# Altium schematic sheet [4]-Ethernet_PHY.SchDoc
size A4
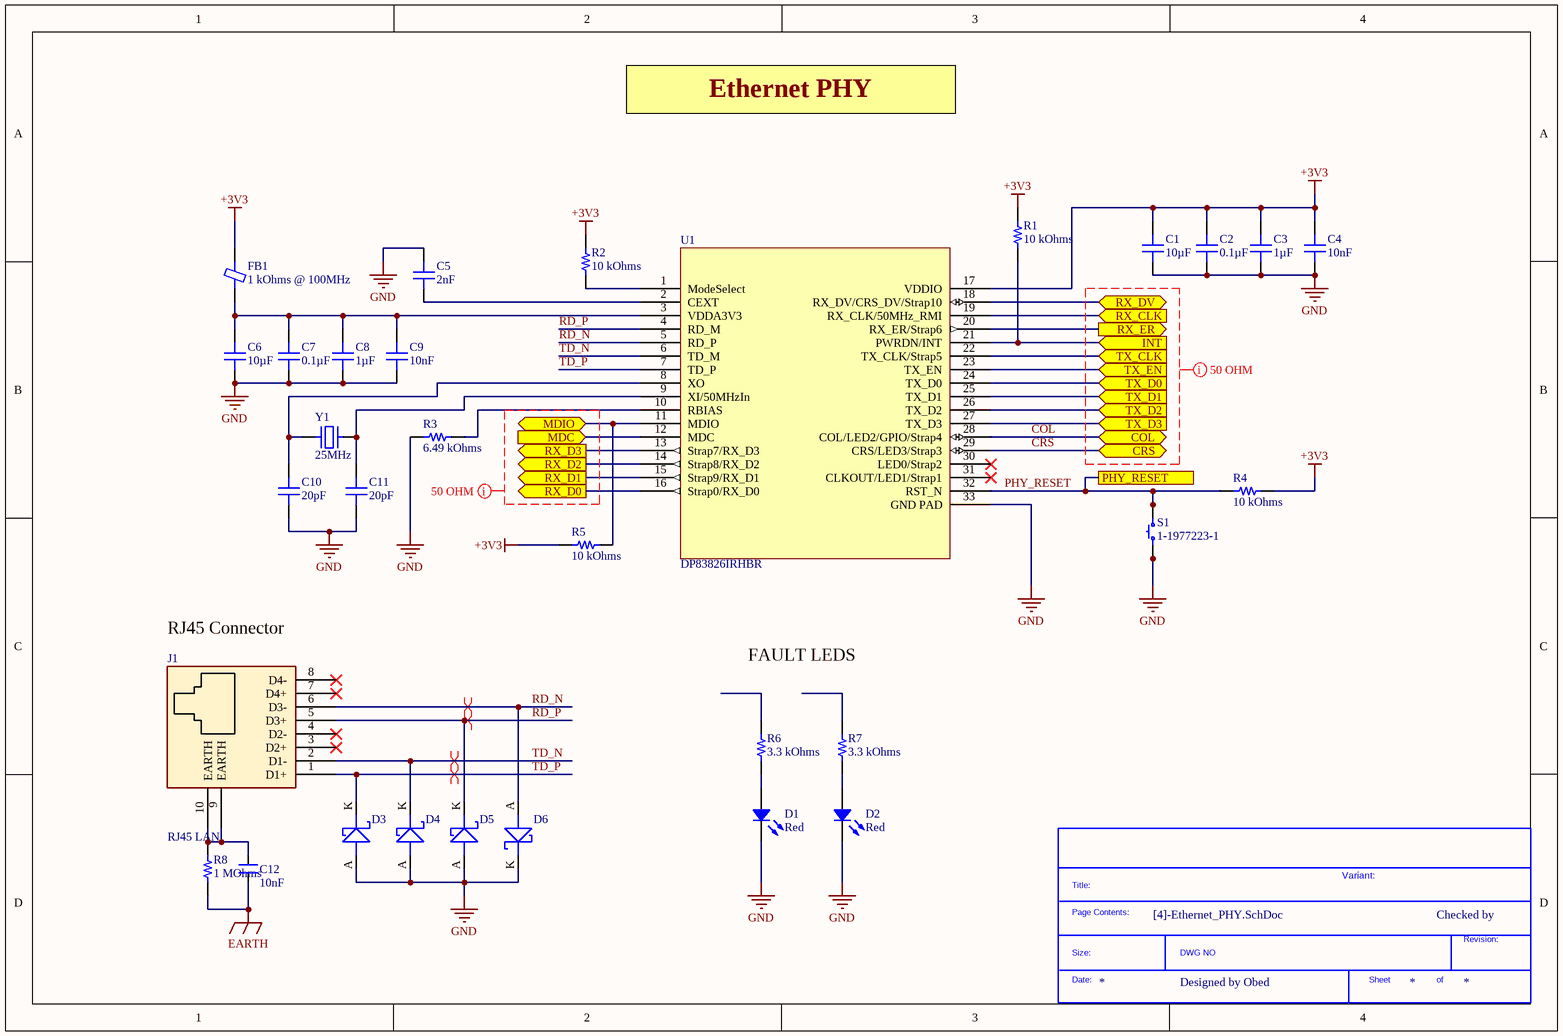
[diagram p0: [4]-Ethernet_PHY.SchDoc]

## Parts
*?  SDTitleBlock  (value not drawn)  (graphical)
C1  10µF  [CAP 1206_3216 - 1.8MM]
C2  0.1µF  [CAP 0805_2012]
C3  1µF  [CAP 0805_2012]
C4  10nF  [CAP 0805_2012]
C5  2nF  [CAP 0805_2012]
C6  10µF  [CAP 1206_3216 - 1.8MM]
C7  0.1µF  [CAP 0805_2012]
C8  1µF  [CAP 0805_2012]
C9  10nF  [CAP 0805_2012]
C10  20pF  [CAP 0805_2012]
C11  20pF  [CAP 0805_2012]
C12  10nF  [CAP_P196_102X287_H332_RAD_TH]
D1  Red  [LED 1206_3216 RED]
D2  Red  [LED 1206_3216 RED]
D3  ESD3V3D9-TP  [DIO_SOD-923]  (value not drawn)
D4  ESD3V3D9-TP  [DIO_SOD-923]  (value not drawn)
D5  ESD3V3D9-TP  [DIO_SOD-923]  (value not drawn)
D6  ESD3V3D9-TP  [DIO_SOD-923]  (value not drawn)
FB1  1 kOhms @ 100MHz  [FER 1206_3216]
J1  RJ45 LAN  [CON10_P106_RJ45_TH_ST]
R1  10 kOhms  [RES 0805_2012]
R2  10 kOhms  [RES 0805_2012]
R3  6.49 kOhms  [RES 0805_2012]
R4  10 kOhms  [RES 0805_2012]
R5  10 kOhms  [RES 0805_2012]
R6  3.3 kOhms  [RES 0603_1608]
R7  3.3 kOhms  [RES 0603_1608]
R8  1 MOhms  [RES 1206_3216]
S1  1-1977223-1  [TE FSM4JSMA]
U1  DP83826IRHBR  [VQFN32_19_218_23X9_SMD]
Y1  25MHz  [ABRACON ABLS]

## Ports
COL (bidir), CRS (bidir), INT (in), MDC (in), MDIO (bidir), PHY_RESET, RX_CLK (in), RX_D0 (out), RX_D1 (out), RX_D2 (out), RX_D3 (out), RX_DV (bidir), RX_ER (out), TX_CLK (in), TX_D0 (in), TX_D1 (in), TX_D2 (in), TX_D3 (in), TX_EN (in)

## Nets
+3V3: C1.2 C2.2 C3.2 C4.2 FB1.2 R1.2 R2.2 R4.1 R5.1 U1.17(VDDIO)
EARTH: C12.1 R8.1
GND: C1.1 C2.1 C3.1 C4.1 C5.2 C6.1 C7.1 C8.1 C9.1 C10.1 C11.1 D1.2 D2.2 D3.A D4.A D5.A D6.K R3.1 S1.1 S1.2 U1.33(GND_PAD)
COL: U1.28(COL/LED2/GPIO/Strap4) ; port COL
CRS: U1.29(CRS/LED3/Strap3) ; port CRS
INT: R1.1 U1.21(PWRDN/INT) ; port INT
MDC: U1.12(MDC) ; port MDC
MDIO: R5.2 U1.11(MDIO) ; port MDIO
PHY_RESET: R4.2 S1.3 S1.4 U1.32(RST_N) ; port PHY_RESET
RD_N: D6.A J1.6(D3-) U1.5(RD_P)
RD_P: D5.K J1.5(D3+) U1.4(RD_M)
RX_CLK: U1.19(RX_CLK/50MHz_RMI) ; port RX_CLK
RX_D0: U1.16(Strap0/RX_D0) ; port RX_D0
RX_D1: U1.15(Strap9/RX_D1) ; port RX_D1
RX_D2: U1.14(Strap8/RX_D2) ; port RX_D2
RX_D3: U1.13(Strap7/RX_D3) ; port RX_D3
RX_DV: U1.18(RX_DV/CRS_DV/Strap10) ; port RX_DV
RX_ER: U1.20(RX_ER/Strap6) ; port RX_ER
TD_N: D4.K J1.2(D1-) U1.6(TD_M)
TD_P: D3.K J1.1(D1+) U1.7(TD_P)
TX_CLK: U1.22(TX_CLK/Strap5) ; port TX_CLK
TX_D0: U1.24(TX_D0) ; port TX_D0
TX_D1: U1.25(TX_D1) ; port TX_D1
TX_D2: U1.26(TX_D2) ; port TX_D2
TX_D3: U1.27(TX_D3) ; port TX_D3
TX_EN: U1.23(TX_EN) ; port TX_EN
NetC5_1: C5.1 U1.2(CEXT)
NetC6_2: C6.2 C7.2 C8.2 C9.2 FB1.1 U1.3(VDDA3V3)
NetC10_2: C10.2 U1.8(XO) Y1.1
NetC11_2: C11.2 U1.9(XI/50MHzIn) Y1.2
NetC12_2: C12.2 J1.9(EARTH) J1.10(EARTH) R8.2
NetD1_1: D1.1 R6.2
NetD2_1: D2.1 R7.1
NetR2_1: R2.1 U1.1(ModeSelect)
NetR3_2: R3.2 U1.10(RBIAS)

Not connected (* = marked no-connect by the designer): J1 3(D2+)* 4(D2-)* 7(D4+)* 8(D4-)*; R6 1; R7 2; U1 30(LED0/Strap2)* 31(CLKOUT/LED1/Strap1)*

## Layout directives
net class 50OHM SINGLE-ENDED: (no net found under the mark)
differential pair; differential pair class 100 OHM; net class DIFF100: RD_N, RD_P, TD_N, TD_P

## Notes on the sheet
- Ethernet PHY
- (near J1) RJ45 Connector
- FAULT LEDS
- Variant:
- Checked by
- Designed by Obed
- (in symbol SDTitleBlock) Title:; Page Contents:; Revision:; Size:; DWG NO; Date:; Sheet; of

## Library data of the parts
C1 C6 = 12065D106KAT2A: CAP CER 10UF 50V X5R 1206; Manufacturer: AVX Corporation; Tolerance: ±10%; Part Number: 12065D106KAT2A; Applications: General Purpose; Capacitance: 10µF; ComponentLink1Description: Datasheet; ComponentLink1URL: http://datasheets.avx.com/cx5r.pdf; ComponentLink2Description: DigiKey Link; ComponentLink2URL: http://digikey.com/product-detail/en/avx-corporation/12065D106KAT2A/478-9979-1-ND/6149060; Device Package: 1206 (3216 Metric); LastUpdated: 02/09/2020 01:05:35; Lifecycle Status: Active; Minimum Order: 1; Mounting Type: Surface Mount, MLCC; Operating Temperature: -55°C ~ 85°C; Package / Case: 1206 (3216 Metric); Packaging: TapeAndReel; PartId: 21345; Part Status: Active; Price: 0.16; Series: -; Size / Dimension: 0.126" L x 0.063" W (3.20mm x 1.60mm); Supplier 1: DigiKey; Supplier Part Number 1: 478-9979-1-ND; Temperature Coefficient: X5R; Thickness (Max): 0.071" (1.80mm); Voltage - Rated: 50V; Value: 10µF
C2 C7 = 0805J0500104KXT: CAP CER 0.1UF 50V X7R 0805; Manufacturer: Knowles Syfer; Tolerance: ±10%; Part Number: 0805J0500104KXT; Applications: General Purpose; Capacitance: 0.1µF; ComponentLink1Description: Datasheet; ComponentLink1URL: https://www.knowlescapacitors.com/getattachment/2dbfc8bc-e2b3-4b4d-afb1-43b011b9ebe0/High-Std-Voltage.aspx; ComponentLink2Description: DigiKey Link; ComponentLink2URL: http://digikey.com/product-detail/en/knowles-syfer/0805J0500104KXT/1608-1000-1-ND/5730199; Device Package: 0805 (2012 Metric); LastUpdated: 02/09/2020 01:04:31; Lifecycle Status: Active; Minimum Order: 1; Mounting Type: Surface Mount, MLCC; Operating Temperature: -55°C ~ 125°C; Package / Case: 0805 (2012 Metric); Packaging: TapeAndReel; PartId: 8322; Part Status: Active; Price: 0.17; Series: -; Size / Dimension: 0.079" L x 0.049" W (2.00mm x 1.25mm); Supplier 1: DigiKey; Supplier Part Number 1: 1608-1000-1-ND; Temperature Coefficient: X7R; Thickness (Max): 0.051" (1.30mm); Voltage - Rated: 50V; Value: 0.1µF
C3 C8 = 08055C105K4T2A: CAP CER 1UF 50V X7R 0805; Manufacturer: AVX Corporation; Tolerance: ±10%; Part Number: 08055C105K4T2A; Applications: Automotive; Capacitance: 1µF; ComponentLink1Description: Datasheet; ComponentLink1URL: http://datasheets.avx.com/AutoMLCC.pdf; ComponentLink2Description: DigiKey Link; ComponentLink2URL: http://digikey.com/product-detail/en/avx-corporation/08055C105K4T2A/478-9556-1-ND/5322894; Device Package: 0805 (2012 Metric); LastUpdated: 02/09/2020 01:04:35; Lifecycle Status: Active; Minimum Order: 1; Mounting Type: Surface Mount, MLCC; Operating Temperature: -55°C ~ 125°C; Package / Case: 0805 (2012 Metric); Packaging: TapeAndReel; PartId: 6460; Part Status: Active; Price: 0.08; Ratings: AEC-Q200; Series: -; Size / Dimension: 0.079" L x 0.049" W (2.00mm x 1.25mm); Supplier 1: DigiKey; Supplier Part Number 1: 478-9556-1-ND; Temperature Coefficient: X7R; Thickness (Max): 0.055" (1.40mm); Voltage - Rated: 50V; Value: 1µF
C4 C9 = C0805C103K5GECAUTO: CAP CER 0805 10NF 50V C0G 10%; Manufacturer: KEMET; Capacitance: 10000pF; Temperature Coefficient: C0G, NP0; Part Number: C0805C103K5GECAUTO; Applications: Automotive, ESD Protection; ComponentLink1Description: Datasheet; ComponentLink1URL: https://api.kemet.com/component-edge/download/datasheet/C0805C103K5GECAUTO.pdf; ComponentLink2Description: DigiKey Link; ComponentLink2URL: http://digikey.com/product-detail/en/kemet/C0805C103K5GECAUTO/399-17903-1-ND/8640570; Device Package: 0805 (2012 Metric); Features: Low ESL; LastUpdated: 02/09/2020 01:04:06; Lifecycle Status: Active; Minimum Order: 1; Mounting Type: Surface Mount, MLCC; Operating Temperature: -55°C ~ 125°C; Package / Case: 0805 (2012 Metric); Packaging: TapeAndReel; PartId: 18336; Part Status: Active; Price: 0.06; Ratings: AEC-Q200; Series: ESD SMD Auto C0G; Size / Dimension: 0.079" L x 0.049" W (2.00mm x 1.25mm); Supplier 1: DigiKey; Supplier Part Number 1: 399-17903-1-ND; Thickness (Max): 0.039" (1.00mm); Tolerance: ±10%; Voltage - Rated: 50V; Value: 10nF
C5 = C0805C202K5RACTU: CAP CER 2000PF 50V X7R 0805; Manufacturer: KEMET; Tolerance: ±10%; Part Number: C0805C202K5RACTU; Applications: Bypass, Decoupling; Capacitance: 2000pF; ComponentLink1Description: Datasheet; ComponentLink1URL: https://content.kemet.com/datasheets/KEM_C1002_X7R_SMD.pdf; ComponentLink2Description: DigiKey Link; ComponentLink2URL: http://digikey.com/product-detail/en/kemet/C0805C202K5RACTU/399-7343-1-ND/3316964; Device Package: 0805 (2012 Metric); LastUpdated: 02/09/2020 01:04:17; Lifecycle Status: Active; Minimum Order: 1; Mounting Type: Surface Mount, MLCC; Operating Temperature: -55°C ~ 125°C; Package / Case: 0805 (2012 Metric); Packaging: TapeAndReel; PartId: 14983; Part Status: Active; Price: 0.03; Series: SMD Comm X7R; Size / Dimension: 0.079" L x 0.049" W (2.00mm x 1.25mm); Supplier 1: DigiKey; Supplier Part Number 1: 399-7343-1-ND; Temperature Coefficient: X7R; Thickness (Max): 0.035" (0.88mm); Voltage - Rated: 50V; Value: 2nF
C10 C11 = 08055A200F4T2A: CAP CER 20PF 50V NP0 0805; Manufacturer: AVX Corporation; Temperature Coefficient: C0G, NP0; Tolerance: ±1%; Part Number: 08055A200F4T2A; Applications: Automotive; Capacitance: 20pF; ComponentLink1Description: Datasheet; ComponentLink1URL: http://datasheets.avx.com/C0GNP0-Dielectric.pdf; ComponentLink2Description: DigiKey Link; ComponentLink2URL: http://digikey.com/product-detail/en/avx-corporation/08055A200F4T2A/478-13059-1-ND/9948577; Device Package: 0805 (2012 Metric); LastUpdated: 02/09/2020 01:04:29; Lifecycle Status: Active; Minimum Order: 1; Mounting Type: Surface Mount, MLCC; Operating Temperature: -55°C ~ 125°C; Package / Case: 0805 (2012 Metric); Packaging: TapeAndReel; PartId: 9474; Part Status: Active; Price: 0.11; Ratings: AEC-Q200; Series: -; Size / Dimension: 0.079" L x 0.049" W (2.01mm x 1.25mm); Supplier 1: DigiKey; Supplier Part Number 1: 478-13059-1-ND; Voltage - Rated: 50V; Value: 20pF
C12 = CAP_10nF-1KV-10%-RAD-TH: Cap Ceramic 0.001uF 1000V X7R 10% Radial 5mm 125°C Bulk; Manufacturer: Murata; Manufacturer Part Number: RDER73A102K2K1H03B; Capacitance: 1nF; Voltage Rating: 1kV; Lead/Base Style: Formed Leads; Lead Diameter: 0.5mm; Supplier 1: Digi-Key; RoHS: Yes; Category: Ceramic Capacitors; Stock 1: 6888; Pricing 1: 1=0.75000, 10=0.53200, 50=0.40220, 100=0.35030, 500=0.25946, 1000=0.22055, 2500=0.20758, 5000=0.19460 (USD); Mount: Through Hole; Case/Package: Radial; Min Operating Temperature: -55°C; Max Operating Temperature: 125°C; Package Quantity: 500; Packaging: Bulk; Tolerance: 10%; Dielectric: X7R; Termination: Radial; Resistor Type: Ceramic; Voltage Rating (DC): 1kV; Length: 5.5mm; Width: 0.124inch; Height: 4mm; Height - Seated (Max): 0.157inch; Lead Pitch: 0.197inch; Lead Free: Lead Free; RoHS Compliant: Yes; ComponentLink1URL: https://datasheet.ciiva.com/29539/product-29539129.pdf?src-supplier=Digi-Key; ComponentLink1Description: https://datasheet.ciiva.com/29539/product-29539129.pdf?src-supplier=Digi-Key; Supplier Part Number 1: 490-8942-ND
D1 D2 = APTR3216SECK/J3-PRV: LED SMD; Manufacturer: Kingbright; Configuration: 1206; Current - Test: 20mA; Lens Color: Colorless; Lens Size: 1.60mm x 1.40mm; Lens Style: Rectangle with Flat Top; Lens Transparency: Clear; Millicandela Rating: 350mcd; Viewing Angle: 140°; Voltage - Forward (Vf) (Typ): 2.2V; Wavelength - Dominant: 625nm; Wavelength - Peak: 640nm; Part Number: APTR3216SECK/J3-PRV; Color: Red; ComponentLink1Description: Datasheet; ComponentLink1URL: http://www.kingbrightusa.com/images/catalog/SPEC/APTR3216SECK-J3-PRV.pdf; ComponentLink2Description: DigiKey Link; ComponentLink2URL: http://digikey.com/product-detail/en/kingbright/APTR3216SECK-J3-PRV/754-APTR3216SECK-J3-PRVCT-ND/10293112; Device Package: 1206 (3216 Metric); Height (Max): 1.25mm; LastUpdated: 9/2/2020 01:21:09; Lifecycle Status: Active; Minimum Order: 1; Mounting Type: Surface Mount; Package / Case: 1206 (3216 Metric); Packaging: TapeAndReel; PartId: 194; Part Status: Active; Price: 0.20; Series: Heli-R; Size / Dimension: 3.20mm L x 1.60mm W; Supplier 1: DigiKey; Supplier Part Number 1: 754-APTR3216SECK/J3-PRVCT-ND; Supplier Device Package: 1206; Value: Red
D3-D6 = DIO-T_3.3V-8.8V-SOD923: TVS DIODE 3.3V 8.8V SOD923; Manufacturer: MCC; Capacitance: 35pF; Current Rating: 10mA; Number of Unidirectional Channels: 1; Min Breakdown Voltage: 5V; Clamping Voltage: 5.8V; Peak Pulse Power: 100W; Power Line Protection: No; Peak Pulse Current: 5A; Diode Type: ZENER; Supplier 1: Digi-Key; Manufacturer Part Number: ESD3V3D9-TP; RoHS: Yes; Category: TVS Diodes; Stock 1: 2991; Pricing 1: 1=0.29000, 10=0.23600, 100=0.12540, 500=0.08250, 1000=0.05610, 2000=0.05060 (USD); Mount: Surface Mount; Min Operating Temperature: -55°C; Max Operating Temperature: 150°C; Package Quantity: 1; Packaging: Tape and Reel; Operating Supply Voltage: 3.3V; Reverse Standoff Voltage: 3.3V; Breakdown Voltage: 5V; Number of Channels: 1; Max Power Dissipation: 100W; Termination: SMD/SMT; Resistor Type: Zener; Series: -; Lead Free: Lead Free; RoHS Compliant: Yes; ComponentLink1URL: https://datasheet.ciiva.com/333/esd3v3d9sod-923-333173.pdf?src-supplier=Digi-Key; ComponentLink1Description: https://datasheet.ciiva.com/333/esd3v3d9sod-923-333173.pdf?src-supplier=Digi-Key; ComponentLink2URL: https://datasheet.ciiva.com/4479/esd3v3d9sod-923-36448-4479598.pdf?src-supplier=Mouser; ComponentLink2Description: https://datasheet.ciiva.com/4479/esd3v3d9sod-923-36448-4479598.pdf?src-supplier=Mouser; ComponentLink3URL: https://datasheet.ciiva.com/333/esd3v3d9sod-923-333174.pdf?src-supplier=Digi-Key; ComponentLink3Description: https://datasheet.ciiva.com/333/esd3v3d9sod-923-333174.pdf?src-supplier=Digi-Key; ComponentLink4URL: https://datasheet.ciiva.com/333/esd3v3d9sod-923-333175.pdf?src-supplier=Digi-Key; ComponentLink4Description: https://datasheet.ciiva.com/333/esd3v3d9sod-923-333175.pdf?src-supplier=Digi-Key; Supplier Part Number 1: ESD3V3D9-TPMSCT-ND
FB1 = BLM31KN102SZ1L: FERRITE BEAD 1 KOHM 1206 1LN; Manufacturer: Murata Electronics; Current Rating (Max): 2A; DC Resistance (DCR) (Max): 75mOhm; Filter Type: Power Line; Number of Lines: 1; Part Number: BLM31KN102SZ1L; ComponentLink1Description: Datasheet; ComponentLink1URL: https://www.murata.com/en-global/products/productdata/8796751200286/QNFA9115.pdf; ComponentLink2Description: DigiKey Link; ComponentLink2URL: http://digikey.com/product-detail/en/murata-electronics/BLM31KN102SZ1L/490-16522-1-ND/7564150; Device Package: 1206 (3216 Metric); Height (Max): 0.071" (1.80mm); Impedance @ Frequency: 1 kOhms @ 100MHz; LastUpdated: 02/09/2020 01:18:24; Lifecycle Status: Active; Minimum Order: 1; Mounting Type: Surface Mount; Operating Temperature: -55°C ~ 125°C; Package / Case: 1206 (3216 Metric); Packaging: TapeAndReel; PartId: 1565; Part Status: Active; Price: 0.10; Ratings: AEC-Q200; Series: BLM; Size / Dimension: 0.126" L x 0.063" W (3.20mm x 1.60mm); Supplier 1: DigiKey; Supplier Part Number 1: 490-16522-1-ND; Value: 1 kOhms @ 100MHz
J1 = CON-SKT-RJ_8C8P-RA-TH: 8 Pins, 2 Row 2.54mm Pitch, right angle Connector, male; Manufacturer: Assmann; Manufacturer Part Number: A-2004-2-4-LPS-N-R; Alternate Part Number-1: NA; Case/Package: TH-CON; Supplier-1: SP ROAD; Supplier Part Number-1: A-2004-2-4-LPS-N-R
R1 R2 R4 R5 = CRCW080510K0FKEA: RES SMD 10K OHM 1% 1/8W 0805; Manufacturer: Vishay Dale; Power (Watts): 0.125W, 1/8W; Temperature Coefficient: ±100ppm/°C; Part Number: CRCW080510K0FKEA; ComponentLink1Description: Datasheet; ComponentLink1URL: http://www.vishay.com/docs/20035/dcrcwe3.pdf; ComponentLink2Description: DigiKey Link; ComponentLink2URL: http://digikey.com/product-detail/en/vishay-dale/CRCW080510K0FKEA/541-10.0KCCT-ND/1180897; Composition: Thick Film; Device Package: 0805 (2012 Metric); Features: Automotive AEC-Q200; Height - Seated (Max): 0.020" (0.50mm); LastUpdated: 02/09/2020 01:15:23; Lifecycle Status: Active; Minimum Order: 1; Number of Terminations: 2; Operating Temperature: -55°C ~ 155°C; Package / Case: 0805 (2012 Metric); Packaging: TapeAndReel; PartId: 28101; Part Status: Active; Price: 0.01; Ratings: AEC-Q200; Resistance: 10 kOhms; Series: CRCW; Size / Dimension: 0.079" L x 0.049" W (2.00mm x 1.25mm); Supplier 1: DigiKey; Supplier Part Number 1: 541-10.0KCCT-ND; Supplier Device Package: 0805; Tolerance: ±1%; Value: 10 kOhms
R3 = RMCF0805FT6K49: RES 6.49K OHM 1% 1/8W 0805; Manufacturer: Stackpole Electronics Inc; Power (Watts): 0.125W, 1/8W; Temperature Coefficient: ±100ppm/°C; Part Number: RMCF0805FT6K49; ComponentLink1Description: Datasheet; ComponentLink1URL: https://www.seielect.com/catalog/sei-rmcf_rmcp.pdf; ComponentLink2Description: DigiKey Link; ComponentLink2URL: http://digikey.com/product-detail/en/stackpole-electronics-inc/RMCF0805FT6K49/RMCF0805FT6K49CT-ND/1942423; Composition: Thick Film; Device Package: 0805 (2012 Metric); Features: Automotive AEC-Q200; Height - Seated (Max): 0.026" (0.65mm); LastUpdated: 02/09/2020 01:14:25; Lifecycle Status: Active; Minimum Order: 1; Number of Terminations: 2; Operating Temperature: -55°C ~ 155°C; Package / Case: 0805 (2012 Metric); Packaging: CutTape; PartId: 49590; Part Status: Active; Price: 0.10; Ratings: AEC-Q200; Resistance: 6.49 kOhms; Series: RMCF; Size / Dimension: 0.079" L x 0.049" W (2.00mm x 1.25mm); Supplier 1: DigiKey; Supplier Part Number 1: RMCF0805FT6K49CT-ND; Supplier Device Package: 0805; Tolerance: ±1%; Value: 6.49 kOhms
R6 R7 = ERJ-3EKF3301V: RES SMD 3.3K OHM 1% 1/10W 0603; Manufacturer: Panasonic Electronic Components; Power (Watts): 0.1W, 1/10W; Temperature Coefficient: ±100ppm/°C; Part Number: ERJ-3EKF3301V; ComponentLink1Description: Datasheet; ComponentLink1URL: https://industrial.panasonic.com/cdbs/www-data/pdf/RDA0000/AOA0000C304.pdf; ComponentLink2Description: DigiKey Link; ComponentLink2URL: http://digikey.com/product-detail/en/panasonic-electronic-components/ERJ-3EKF3301V/P3.30KHCT-ND/1746762; Composition: Thick Film; Device Package: 0603 (1608 Metric); Features: Automotive AEC-Q200; Height - Seated (Max): 0.022" (0.55mm); LastUpdated: 9/2/2020 01:10:23; Lifecycle Status: Active; Minimum Order: 1; Number of Terminations: 2; Operating Temperature: -55°C ~ 155°C; Package / Case: 0603 (1608 Metric); Packaging: TapeAndReel; PartId: 5657; Part Status: Active; Price: 0.01; Ratings: AEC-Q200; Resistance: 3.3 kOhms; Series: ERJ; Size / Dimension: 0.063" L x 0.031" W (1.60mm x 0.80mm); Supplier 1: DigiKey; Supplier Part Number 1: P3.30KHCT-ND; Supplier Device Package: 0603; Tolerance: ±1%; Value: 3.3 kOhms
R8 = CRG1206F1M0: RES SMD 1M OHM 1% 1/4W 1206; Manufacturer: TE Connectivity Passive Product; Power (Watts): 0.25W, 1/4W; Temperature Coefficient: ±100ppm/°C; Part Number: CRG1206F1M0; ComponentLink1Description: Datasheet; ComponentLink1URL: https://www.te.com/commerce/DocumentDelivery/DDEController?Action=srchrtrv&DocNm=1773204&DocType=DS&DocLang=English; ComponentLink2Description: DigiKey Link; ComponentLink2URL: http://digikey.com/product-detail/en/te-connectivity-passive-product/CRG1206F1M0/A106072CT-ND/3477725; Composition: Thick Film; Device Package: 1206 (3216 Metric); Height - Seated (Max): 0.026" (0.65mm); LastUpdated: 02/09/2020 01:13:10; Lifecycle Status: Active; Minimum Order: 1; Number of Terminations: 2; Operating Temperature: -55°C ~ 155°C; Package / Case: 1206 (3216 Metric); Packaging: TapeAndReel; PartId: 26984; Part Status: Active; Price: 0.01; Resistance: 1 MOhms; Series: CRG, Neohm; Size / Dimension: 0.122" L x 0.061" W (3.10mm x 1.55mm); Supplier 1: DigiKey; Supplier Part Number 1: A106072CT-ND; Supplier Device Package: 1206; Tolerance: ±1%; Value: 1 MOhms
S1 = 1-1977223-1: SWITCH TACTILE SPST-NO 0.05A 24V; Manufacturer: TE Connectivity ALCOSWITCH Switches; Actuator Height off PCB, Vertical: 5.00mm; Actuator Orientation: Top Actuated; Actuator Type: Standard; Contact Rating @ Voltage: 0.05A @ 24VDC; Illumination: Non-Illuminated; Operating Force: 260gf; Outline: 6.00mm x 6.00mm; Switch Function: Off-Mom; Part Number: 1-1977223-1; Circuit: SPST-NO; ComponentLink1Description: Datasheet; ComponentLink1URL: https://www.te.com/commerce/DocumentDelivery/DDEController?Action=srchrtrv&DocNm=1308111-1_SWITCHES_CORE_PROGRAM_CATALOG&DocType=CS&DocLang=English; ComponentLink2Description: DigiKey Link; ComponentLink2URL: http://digikey.com/product-detail/en/te-connectivity-alcoswitch-switches/1-1977223-1/1-1977223-1-ND/5597032; LastUpdated: 02/09/2020 01:27:07; Lifecycle Status: Active; Minimum Order: 0; Mounting Type: Surface Mount; Price: 0; Series: FSMJSMA; Supplier 1: DigiKey; Supplier Part Number 1: 1-1977223-1-ND; Termination Style: Gull Wing
U1 = IC_DP83826IRHBR: Ethernet MAC Controller IEEE 802.3, 10/100 Base-T/TX PHY MII, RMII Interface 32-VQFN (5x5); Manufacturer: Texas Instruments; Supplier 1: Digi-Key; Manufacturer Part Number: DP83826IRHBR; RoHS: Yes; Pricing 1: 1=2.14000, 10=1.91900, 25=1.81000, 100=1.54210, 250=1.44796, 500=1.26696, 1000=1.14061 (USD); Supplier Part Number 1: 296-DP83826IRHBRCT-ND
Y1 = ABLS-25.000MHZ-20-D2YF-T: CRYSTAL 25.000MHZ 20PF SMD; Manufacturer: Abracon LLC; ESR (Equivalent Series Resistance): 40 Ohms; Frequency Stability: ±30ppm; Frequency Tolerance: ±20ppm; Operating Mode: Fundamental; Part Number: ABLS-25.000MHZ-20-D2YF-T; ComponentLink1Description: Datasheet; ComponentLink1URL: https://abracon.com/Resonators/abls.pdf; ComponentLink2Description: DigiKey Link; ComponentLink2URL: http://digikey.com/product-detail/en/abracon-llc/ABLS-25.000MHZ-20-D2YF-T/535-14354-1-ND/8582115; Frequency: 25MHz; Height - Seated (Max): 0.165" (4.20mm); LastUpdated: 02/09/2020 01:21:46; Lifecycle Status: Active; Load Capacitance: 20pF; Minimum Order: 1; Mounting Type: Surface Mount; Operating Temperature: -40°C ~ 85°C; Package / Case: HC-49/US; Packaging: TapeAndReel; PartId: 14; Part Status: Active; Price: 0.24; Series: ABLS; Size / Dimension: 0.449" L x 0.185" W (11.40mm x 4.70mm); Supplier 1: DigiKey; Supplier Part Number 1: 535-14354-1-ND; Type: MHz Crystal; Value: 25MHz